# Altium schematic sheet heaters-sensors.SchDoc
size A4
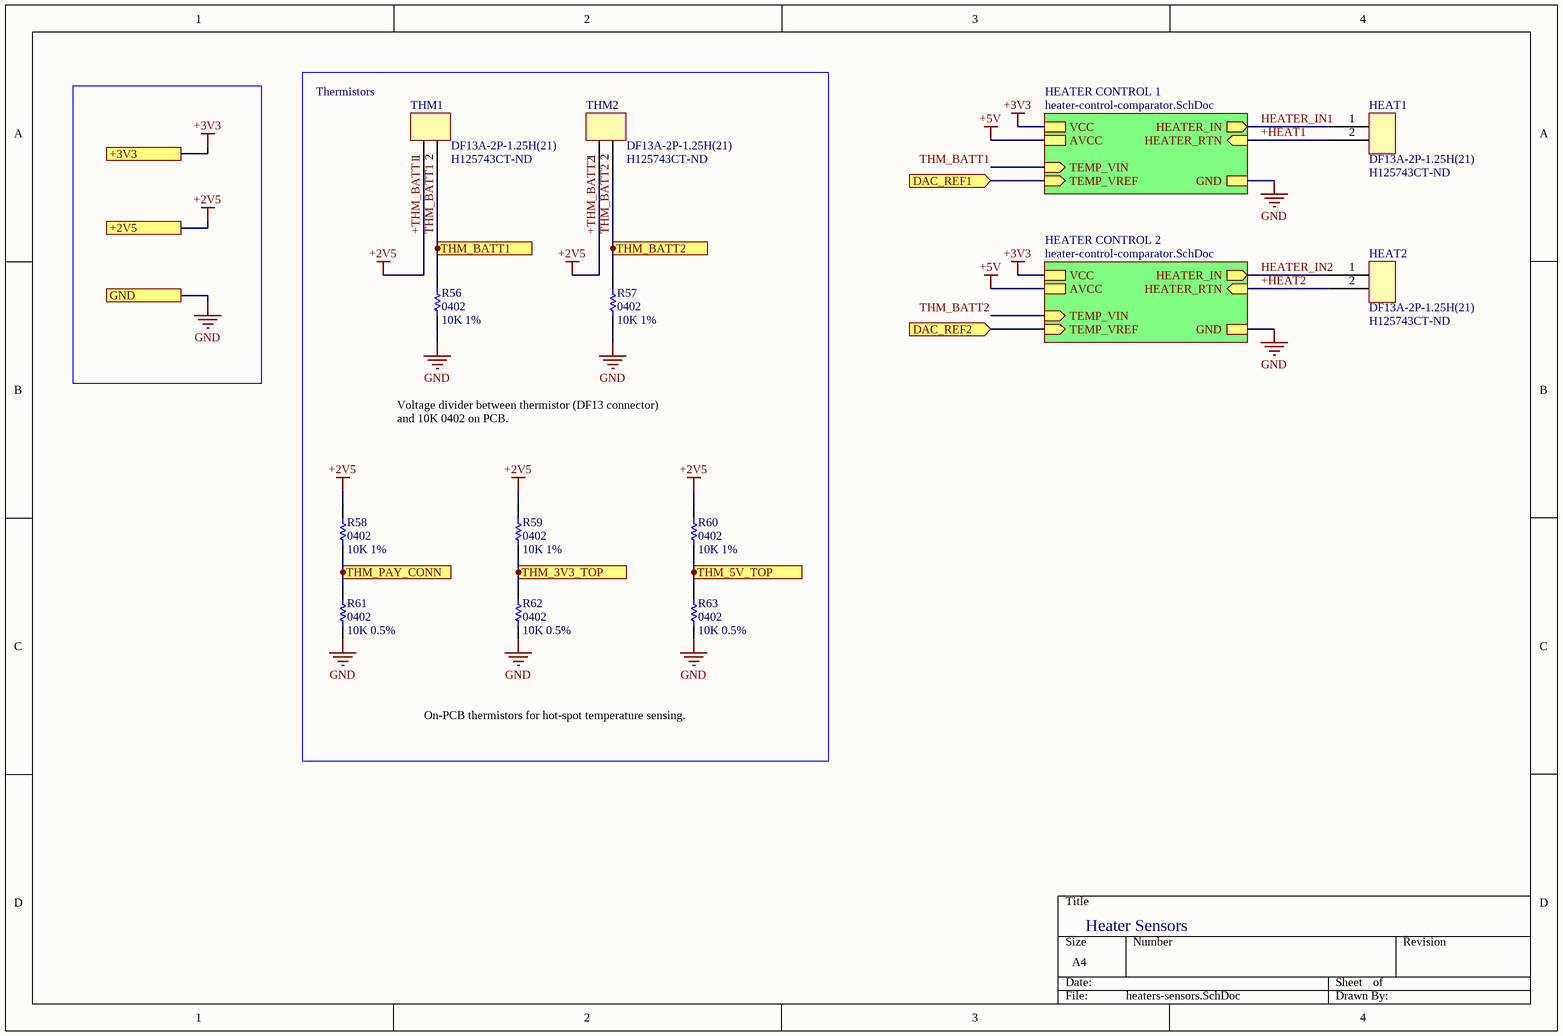
[diagram p0: heaters-sensors.SchDoc]

## Parts
HEAT1  DF13A-2P-1.25H(21)  Supplier Part Number 1: H125743CT-ND  [DF13A-2P-1.25H(21)]
HEAT2  DF13A-2P-1.25H(21)  Supplier Part Number 1: H125743CT-ND  [DF13A-2P-1.25H(21)]
R56  0402  value 10K 1%  [RES0402R]
R57  0402  value 10K 1%  [RES0402R]
R58  0402  value 10K 1%  [RES0402R]
R59  0402  value 10K 1%  [RES0402R]
R60  0402  value 10K 1%  [RES0402R]
R61  0402  value 10K 0.5%  [RES0402R]
R62  0402  value 10K 0.5%  [RES0402R]
R63  0402  value 10K 0.5%  [RES0402R]
THM1  DF13A-2P-1.25H(21)  Supplier Part Number 1: H125743CT-ND  [DF13A-2P-1.25H(21)]
THM2  DF13A-2P-1.25H(21)  Supplier Part Number 1: H125743CT-ND  [DF13A-2P-1.25H(21)]

## Blocks framed on the sheet
Thermistors: R56-R63 THM1 THM2

## Sub-sheets
HEATER CONTROL 1 = heater-control-comparator.SchDoc: GND, TEMP_VIN (in), TEMP_VREF (in), HEATER_IN (out), VCC, AVCC, HEATER_RTN (in)
HEATER CONTROL 2 = heater-control-comparator.SchDoc: GND, TEMP_VIN (in), TEMP_VREF (in), HEATER_IN (out), VCC, AVCC, HEATER_RTN (in)

## Ports
+2V5, +3V3, DAC_REF1 (in), DAC_REF2 (in), GND, THM_3V3_TOP (out), THM_5V_TOP (out), THM_BATT1 (out), THM_BATT2 (out), THM_PAY_CONN (out)

## Nets
+3V3: port +3V3, sheet HEATER CONTROL 1/VCC, sheet HEATER CONTROL 2/VCC
+5V: sheet HEATER CONTROL 1/AVCC, sheet HEATER CONTROL 2/AVCC
+THM_BATT1: R58.2 R59.2 R60.2 THM1.1 THM2.1 ; port +2V5  [also labelled +2V5, +THM_BATT2]
GND: R56.1 R57.1 R61.1 R62.1 R63.1 ; port GND, sheet HEATER CONTROL 1/GND, sheet HEATER CONTROL 2/GND
+HEAT1: HEAT1.2 ; sheet HEATER CONTROL 1/HEATER_RTN
+HEAT2: HEAT2.2 ; sheet HEATER CONTROL 2/HEATER_RTN
DAC_REF1: port DAC_REF1, sheet HEATER CONTROL 1/TEMP_VREF
DAC_REF2: port DAC_REF2, sheet HEATER CONTROL 2/TEMP_VREF
HEATER_IN1: HEAT1.1 ; sheet HEATER CONTROL 1/HEATER_IN
HEATER_IN2: HEAT2.1 ; sheet HEATER CONTROL 2/HEATER_IN
THM_3V3_TOP: R59.1 R62.2 ; port THM_3V3_TOP
THM_5V_TOP: R60.1 R63.2 ; port THM_5V_TOP
THM_BATT1: R56.2 THM1.2 ; port THM_BATT1, sheet HEATER CONTROL 1/TEMP_VIN
THM_BATT2: R57.2 THM2.2 ; port THM_BATT2, sheet HEATER CONTROL 2/TEMP_VIN
THM_PAY_CONN: R58.1 R61.2 ; port THM_PAY_CONN

## Notes on the sheet
- Voltage divider between thermistor (DF13 connector) and 10K 0402 on PCB.
- On-PCB thermistors for hot-spot temperature sensing.
- Heater Sensors

## Library data of the parts
HEAT1 HEAT2 THM1 THM2 = DF13A-2P-1.25H(21): 2 pos DF13 right angle surface mount connector; Supplier 1: Digi-Key
R56-R60 = RES0402: 0402 resistor
R61-R63 = RES0402: 0402 thermistor; Supplier 1: Digi-Key; Supplier Part Number 1: 490-12810-1-ND